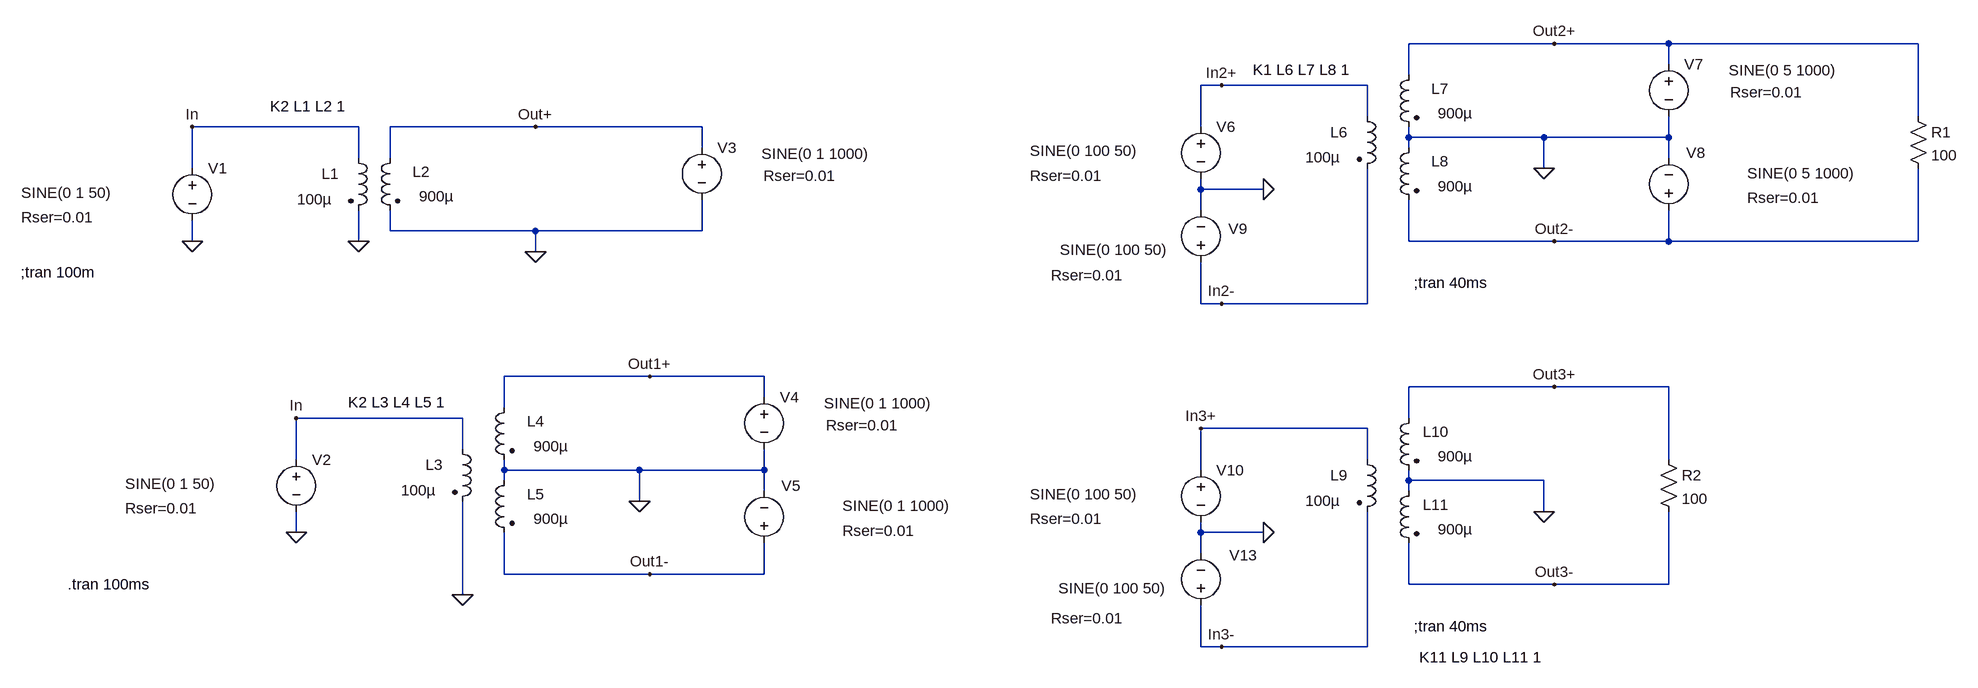
[diagram p0: schematic AC Power Flow ver 1.1.asc]
AC Power Flow ver 1.1.asc, the LTspice schematic file:
Version 4
SHEET 1 1812 700
WIRE 1168 -656 944 -656
WIRE 1344 -656 1168 -656
WIRE 1728 -656 1344 -656
WIRE 1344 -624 1344 -656
WIRE 944 -608 944 -656
WIRE 656 -592 624 -592
WIRE 880 -592 656 -592
WIRE 880 -544 880 -592
WIRE 1728 -544 1728 -656
WIRE -672 -528 -928 -528
WIRE -400 -528 -624 -528
WIRE -144 -528 -400 -528
WIRE 624 -528 624 -592
WIRE 944 -512 944 -528
WIRE 1152 -512 944 -512
WIRE 1344 -512 1344 -544
WIRE 1344 -512 1152 -512
WIRE -144 -496 -144 -528
WIRE 944 -496 944 -512
WIRE -672 -480 -672 -528
WIRE -624 -480 -624 -528
WIRE 1344 -480 1344 -512
WIRE -928 -464 -928 -528
WIRE 1152 -464 1152 -512
WIRE 624 -432 624 -448
WIRE 720 -432 624 -432
WIRE 624 -400 624 -432
WIRE -624 -368 -624 -400
WIRE -400 -368 -624 -368
WIRE -144 -368 -144 -416
WIRE -144 -368 -400 -368
WIRE -928 -352 -928 -384
WIRE -672 -352 -672 -400
WIRE 944 -352 944 -416
WIRE 1168 -352 944 -352
WIRE 1344 -352 1344 -400
WIRE 1344 -352 1168 -352
WIRE 1728 -352 1728 -464
WIRE 1728 -352 1344 -352
WIRE -400 -336 -400 -368
WIRE 624 -256 624 -320
WIRE 656 -256 624 -256
WIRE 880 -256 880 -464
WIRE 880 -256 656 -256
WIRE -224 -144 -448 -144
WIRE -48 -144 -224 -144
WIRE 1168 -128 944 -128
WIRE 1344 -128 1168 -128
WIRE -48 -112 -48 -144
WIRE -448 -96 -448 -144
WIRE -512 -80 -768 -80
WIRE 944 -80 944 -128
WIRE 880 -64 624 -64
WIRE -512 -32 -512 -80
WIRE -768 -16 -768 -80
WIRE 880 -16 880 -64
WIRE 1344 -16 1344 -128
WIRE -448 0 -448 -16
WIRE -240 0 -448 0
WIRE -48 0 -48 -32
WIRE -48 0 -240 0
WIRE 624 0 624 -64
WIRE -448 16 -448 0
WIRE 944 16 944 0
WIRE 1152 16 944 16
WIRE -48 32 -48 0
WIRE 944 32 944 16
WIRE -240 48 -240 0
WIRE 1152 64 1152 16
WIRE -768 96 -768 64
WIRE 624 96 624 80
WIRE 720 96 624 96
WIRE 624 128 624 96
WIRE -448 160 -448 96
WIRE -224 160 -448 160
WIRE -48 160 -48 112
WIRE -48 160 -224 160
WIRE 944 176 944 112
WIRE 1168 176 944 176
WIRE 1344 176 1344 64
WIRE 1344 176 1168 176
WIRE -512 192 -512 48
WIRE 624 272 624 208
WIRE 656 272 624 272
WIRE 880 272 880 64
WIRE 880 272 656 272
FLAG -928 -352 0
FLAG -672 -352 0
FLAG -400 -528 Out+
FLAG -928 -528 In
FLAG -400 -336 0
FLAG -768 96 0
FLAG -512 192 0
FLAG -224 -144 Out1+
FLAG -768 -80 In
FLAG -240 48 0
FLAG -224 160 Out1-
FLAG 720 -432 0
FLAG 1168 -656 Out2+
FLAG 656 -592 In2+
FLAG 1152 -464 0
FLAG 1168 -352 Out2-
FLAG 720 96 0
FLAG 1168 -128 Out3+
FLAG 624 -64 In3+
FLAG 1152 64 0
FLAG 1168 176 Out3-
FLAG 656 272 In3-
FLAG 656 -256 In2-
SYMBOL ind2 -688 -496 R0
WINDOW 0 -41 40 Left 2
WINDOW 3 -79 79 Left 2
SYMATTR InstName L1
SYMATTR Value 100µ
SYMATTR Type ind
SYMBOL ind2 -608 -496 M0
WINDOW 0 -46 37 Left 2
WINDOW 3 -83 75 Left 2
SYMATTR InstName L2
SYMATTR Value 900µ
SYMATTR Type ind
SYMBOL voltage -928 -480 R0
WINDOW 3 -263 53 Left 2
WINDOW 123 0 0 Left 2
WINDOW 39 -263 91 Left 2
SYMATTR InstName V1
SYMATTR Value SINE(0 1 50)
SYMATTR SpiceLine Rser=0.01
SYMBOL ind2 -528 -48 R0
WINDOW 0 -41 40 Left 2
WINDOW 3 -79 79 Left 2
SYMATTR InstName L3
SYMATTR Value 100µ
SYMATTR Type ind
SYMATTR SpiceLine Rser=0.01
SYMBOL ind2 -432 -112 M0
WINDOW 0 -46 37 Left 2
WINDOW 3 -83 75 Left 2
SYMATTR InstName L4
SYMATTR Value 900µ
SYMATTR Type ind
SYMATTR SpiceLine Rser=.01
SYMBOL voltage -768 -32 R0
WINDOW 3 -263 53 Left 2
WINDOW 123 0 0 Left 2
WINDOW 39 -263 91 Left 2
SYMATTR InstName V2
SYMATTR Value SINE(0 1 50)
SYMATTR SpiceLine Rser=0.01
SYMBOL ind2 -432 0 M0
WINDOW 0 -46 37 Left 2
WINDOW 3 -83 75 Left 2
SYMATTR InstName L5
SYMATTR Value 900µ
SYMATTR Type ind
SYMATTR SpiceLine Rser=0.01
SYMBOL voltage -144 -512 R0
WINDOW 3 92 25 Left 2
WINDOW 123 0 0 Left 2
WINDOW 39 95 59 Left 2
SYMATTR InstName V3
SYMATTR Value SINE(0 1 1000)
SYMATTR SpiceLine Rser=0.01
SYMBOL voltage -48 -128 R0
WINDOW 3 92 25 Left 2
WINDOW 123 0 0 Left 2
WINDOW 39 95 59 Left 2
SYMATTR InstName V4
SYMATTR Value SINE(0 1 1000)
SYMATTR SpiceLine Rser=0.01
SYMBOL voltage -48 128 R180
WINDOW 0 -56 104 Left 2
WINDOW 3 -287 73 Left 2
WINDOW 123 0 0 Left 2
WINDOW 39 -233 35 Left 2
SYMATTR InstName V5
SYMATTR Value SINE(0 1 1000)
SYMATTR SpiceLine Rser=0.01
SYMBOL ind2 864 -560 R0
WINDOW 0 -41 40 Left 2
WINDOW 3 -79 79 Left 2
SYMATTR InstName L6
SYMATTR Value 100µ
SYMATTR Type ind
SYMATTR SpiceLine Rser=0.01
SYMBOL ind2 960 -624 M0
WINDOW 0 -46 37 Left 2
WINDOW 3 -83 75 Left 2
SYMATTR InstName L7
SYMATTR Value 900µ
SYMATTR Type ind
SYMATTR SpiceLine Rser=.01
SYMBOL voltage 624 -544 R0
WINDOW 3 -263 53 Left 2
WINDOW 123 0 0 Left 2
WINDOW 39 -263 91 Left 2
SYMATTR InstName V6
SYMATTR Value SINE(0 100 50)
SYMATTR SpiceLine Rser=0.01
SYMBOL ind2 960 -512 M0
WINDOW 0 -46 37 Left 2
WINDOW 3 -83 75 Left 2
SYMATTR InstName L8
SYMATTR Value 900µ
SYMATTR Type ind
SYMATTR SpiceLine Rser=0.01
SYMBOL voltage 1344 -640 R0
WINDOW 3 92 25 Left 2
WINDOW 123 0 0 Left 2
WINDOW 39 95 59 Left 2
SYMATTR InstName V7
SYMATTR Value SINE(0 5 1000)
SYMATTR SpiceLine Rser=0.01
SYMBOL voltage 1344 -384 R180
WINDOW 0 -56 104 Left 2
WINDOW 3 -287 73 Left 2
WINDOW 123 0 0 Left 2
WINDOW 39 -233 35 Left 2
SYMATTR InstName V8
SYMATTR Value SINE(0 5 1000)
SYMATTR SpiceLine Rser=0.01
SYMBOL voltage 624 -304 R180
WINDOW 0 -72 67 Left 2
WINDOW 3 50 35 Left 2
WINDOW 123 0 0 Left 2
WINDOW 39 118 -4 Left 2
SYMATTR InstName V9
SYMATTR Value SINE(0 100 50)
SYMATTR SpiceLine Rser=0.01
SYMBOL ind2 864 -32 R0
WINDOW 0 -41 40 Left 2
WINDOW 3 -79 79 Left 2
SYMATTR InstName L9
SYMATTR Value 100µ
SYMATTR Type ind
SYMATTR SpiceLine Rser=0.01
SYMBOL ind2 960 -96 M0
WINDOW 0 -46 37 Left 2
WINDOW 3 -83 75 Left 2
SYMATTR InstName L10
SYMATTR Value 900µ
SYMATTR Type ind
SYMATTR SpiceLine Rser=.01
SYMBOL voltage 624 -16 R0
WINDOW 3 -263 53 Left 2
WINDOW 123 0 0 Left 2
WINDOW 39 -263 91 Left 2
SYMATTR InstName V10
SYMATTR Value SINE(0 100 50)
SYMATTR SpiceLine Rser=0.01
SYMBOL ind2 960 16 M0
WINDOW 0 -46 37 Left 2
WINDOW 3 -83 75 Left 2
SYMATTR InstName L11
SYMATTR Value 900µ
SYMATTR Type ind
SYMATTR SpiceLine Rser=0.01
SYMBOL voltage 624 224 R180
WINDOW 0 -87 93 Left 2
WINDOW 3 53 42 Left 2
WINDOW 123 0 0 Left 2
WINDOW 39 118 -4 Left 2
SYMATTR InstName V13
SYMATTR Value SINE(0 100 50)
SYMATTR SpiceLine Rser=0.01
SYMBOL res 1712 -560 R0
SYMATTR InstName R1
SYMATTR Value 100
SYMBOL res 1328 -32 R0
SYMATTR InstName R2
SYMATTR Value 100
TEXT -808 -560 Left 2 !K2 L1 L2 1
TEXT -1192 -304 Left 2 !;tran 100m
TEXT -688 -104 Left 2 !K2 L3 L4 L5 1
TEXT -1120 176 Left 2 !.tran 100ms
TEXT 704 -616 Left 2 !K1 L6 L7 L8 1
TEXT 952 -288 Left 2 !;tran 40ms
TEXT 960 288 Left 2 !K11 L9 L10 L11 1
TEXT 952 240 Left 2 !;tran 40ms

The netlist it stands for:
* AC Power Flow ver 1.1.asc
L1 In 0 100µ
L2 Out+ 0 900µ
V1 In 0 SINE(0 1 50) Rser=0.01
L3 In 0 100µ Rser=0.01
L4 Out1+ 0 900µ Rser=.01
V2 In 0 SINE(0 1 50) Rser=0.01
L5 0 Out1- 900µ Rser=0.01
V3 Out+ 0 SINE(0 1 1000) Rser=0.01
V4 Out1+ 0 SINE(0 1 1000) Rser=0.01
V5 Out1- 0 SINE(0 1 1000) Rser=0.01
L6 In2+ In2- 100µ Rser=0.01
L7 Out2+ 0 900µ Rser=.01
V6 In2+ 0 SINE(0 100 50) Rser=0.01
L8 0 Out2- 900µ Rser=0.01
V7 Out2+ 0 SINE(0 5 1000) Rser=0.01
V8 Out2- 0 SINE(0 5 1000) Rser=0.01
V9 In2- 0 SINE(0 100 50) Rser=0.01
L9 In3+ In3- 100µ Rser=0.01
L10 Out3+ 0 900µ Rser=.01
V10 In3+ 0 SINE(0 100 50) Rser=0.01
L11 0 Out3- 900µ Rser=0.01
V13 In3- 0 SINE(0 100 50) Rser=0.01
R1 Out2+ Out2- 100
R2 Out3+ Out3- 100
K2 L1 L2 1
;tran 100m
K2 L3 L4 L5 1
.tran 100ms
K1 L6 L7 L8 1
;tran 40ms
K11 L9 L10 L11 1
;tran 40ms
.backanno
.end